# EAGLE design ssd1306-i2c-oled-breakout (EAGLE 6.6.0)
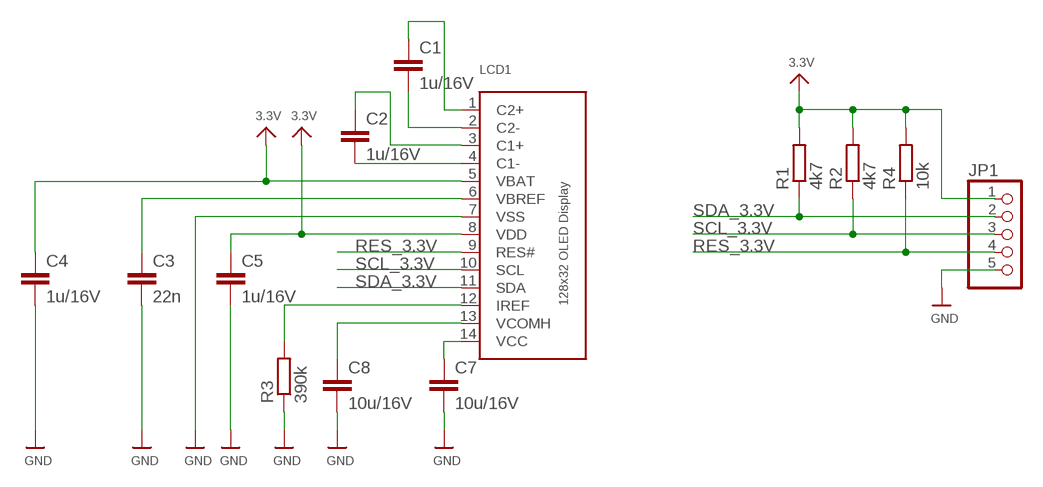
[diagram p0: schematic, sheet 1]

## Parts
C1  1u/16V  C-EUC0603  [C0603]
C2  1u/16V  C-EUC0603  [C0603]
C3  22n  C-EUC0603  [C0603]
C4  1u/16V  C-EUC0603  [C0603]
C5  1u/16V  C-EUC0603  [C0603]
C7  10u/16V  C-EUC0805  [C0805]
C8  10u/16V  C-EUC0805  [C0805]
JP1  PINHD-1X5  [1X05]
LCD1  DISP_OLED_UG-2832HSWEG02  [UG-2832HSWEG02_WRAPUNDER]
R1  4k7  R-EU_R0805  [R0805]
R2  4k7  R-EU_R0805  [R0805]
R3  390k  R-EU_R0603  [R0603]
R4  10k  R-EU_R0805  [R0805]

## Nets
3.3V: C4.1 C5.1 JP1.1 LCD1.5(VBAT) LCD1.8(VDD) R1.2 R2.2 R4.2
GND: C3.2 C4.2 C5.2 C7.2 C8.2 JP1.5 LCD1.7(VSS) R3.1
N$1: C2.2 LCD1.4(C1-)
N$2: C2.1 LCD1.3(C1+)
N$3: C1.2 LCD1.2(C2-)
N$4: C1.1 LCD1.1(C2+)
N$5: C7.1 LCD1.14(VCC)
N$6: C8.1 LCD1.13(VCOMH)
N$7: LCD1.12(IREF) R3.2
N$8: C3.1 LCD1.6(VBREF)
RES_3.3V: JP1.4 LCD1.9(RES#) R4.1
SCL_3.3V: JP1.3 LCD1.10(SCL) R2.1
SDA_3.3V: JP1.2 LCD1.11(SDA) R1.1

## Library data of the parts
C1-C5 C7 C8 = resistor:C-EU: CAPACITOR, European symbol
JP1 = pinhead:PINHD-1X5: PIN HEADER
LCD1 = microbuilder:DISP_OLED_UG-2832HSWEG02: 128x32 I2C 0.91" Monochrome OLED Display
R1-R4 = resistor:R-EU_: RESISTOR, European symbol

## Board
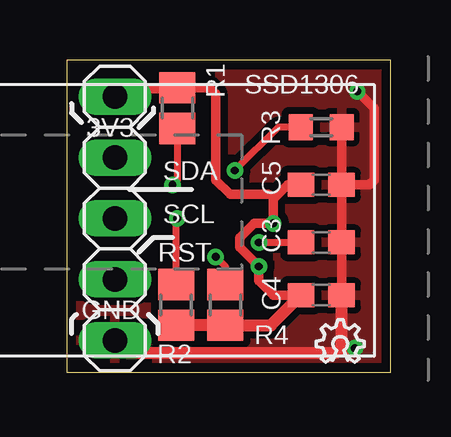
[diagram p1: board, top side]
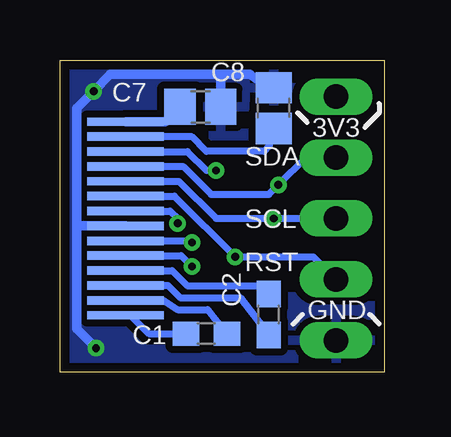
[diagram p2: board, bottom side, seen from below]

Size 13.5 x 13 mm. Coordinates in mm from the lower left corner, seen from the top.
Outline: 0,0 13.5,0 13.5,13 0,13 0,0
Copper layers (1*16): Top 0.0356mm / dielectric 1.5011mm / Bottom 0.0356mm
Design rules "LaenPCBOrder *": minimum track width 6mil, minimum drill 13mil, track to track 6mil, track to pad 6mil, pad to pad 6mil, via to via 6mil, smd to smd 0mil, copper to edge 15mil, drill to drill 6mil, minimum pad ring 7mil, minimum via ring 7mil, stop-mask expansion 3mil, vias tented up to drill 0.4mm, thermal gap 10mil

### Footprints (pad centres in the part's own frame; a part is rotated, then mirrored left to right if it is on the bottom)
C0603 = smd 1.1 x 1: 1 -0.85,0; 2 0.85,0
C0805 = smd 1.3 x 1.5: 1 -0.85,0; 2 0.85,0
1X05 = drill 1.016 long: 1 -5.08,0; 2 -2.54,0; 3 0,0; 4 2.54,0; 5 5.08,0
UG-2832HSWEG02_WRAPUNDER = smd 3.2 x 0.35 bottom: 1 -2.03,-4.03; 2 -2.03,-3.41; 3 -2.03,-2.79; 4 -2.03,-2.17; 5 -2.03,-1.55; 6 -2.03,-0.93; 7 -2.03,-0.31; 8 -2.03,0.31; 9 -2.03,0.93; 10 -2.03,1.55; 11 -2.03,2.17; 12 -2.03,2.79; 13 -2.03,3.41; 14 -2.03,4.03
R0805 = smd 1.3 x 1.5: 1 -0.85,0; 2 0.85,0
R0603 = smd 1 x 1.1: 1 -0.85,0; 2 0.85,0

### Placement (x,y rotation side)
C1  7.4,1.6 0 bottom
C2  4.8,2.4 90 bottom
C3  10.6,5.4 0 top
C4  10.6,3.2 0 top
C5  10.6,7.8 0 top
C7  7.65,11.05 0 bottom
C8  4.6,11 90 bottom
JP1  2,6.4 270 top
LCD1  12.8,6.4 0 top
R1  4.6,11 90 top
R2  4.55,2.8 270 top
R3  10.6,10.2 180 top
R4  6.6,2.8 270 top
U$12  [OSHW_6X70_NOTEXT]  10.4,0.4 0 top

### Tracks (layer width: path | path; a pad name or v marks a point on that pad's centre or on a via)
3.3V  (via drill 0.33)
  Top 0.3: 9.2,7.8 C5.1 | 8.4,7.4 8.6,7.2
  Top 0.4: JP1.1 2.88,11.48 3.2,11.8 4.55,11.8 R1.2 5.95,11.85 6.2,11.6 6.2,8 6.8,7.4 8.4,7.4 | 9.2,7.8 8.6,7.2 v8.6,6.2 7.8,6.2 7.2,5.6 7.2,5.2 v8,4.4 8,3.8 8.6,3.2 C4.1
  Top 0.5: R2.2 R4.2 8.5,1.95 C4.1
  Bottom 0.3: LCD1.5 8.45,4.85 v8,4.4 | LCD1.8 8.91,6.71 8.6,6.4 v8.6,6.2
GND  (via drill 0.33)
  Top 0.4: R3.1 C5.2 | C5.2 C3.2 C4.2 | C5.2 12.6,7.8 12.8,8 12.8,11 v12.1,11.7 | v12,1 11.8,0.8 2.52,0.8
  Top 0.5: JP1.5 2.52,0.8 11.2,0.8 11.45,1.05 C4.2
  Bottom 0.4: 12.8,6.2 12.8,11 v12.1,11.7 11.4,12.4 6.8,12.4 | LCD1.7 12.69,6.09 12.8,6.2 | C8.2 4.65,11.9 4.9,11.9 5.6,12.4 6.8,12.4 | C7.2 6.8,12.4 | 12.8,6.2 12.8,1.8 v12,1
  pour Bottom (isolate 0.3): 0,13 13.6,13 13.6,0 0,0
  pour Top (isolate 0.3): 0,13 13.6,13 13.6,0 0,0
N$1
  Bottom 0.3: LCD1.4 8.83,4.23 8.2,3.6 5.15,3.6 C2.2
N$2
  Bottom 0.3: LCD1.3 9.01,3.61 8.5,3.1 6,3.1 C2.1
N$3
  Bottom 0.3: LCD1.2 9.19,2.99 8.6,2.6 7.35,2.6 C1.2
N$4
  Bottom 0.3: LCD1.1 10.57,2.37 9.8,1.6 C1.1
N$5
  Bottom 0.4: LCD1.14 9.12,10.43 C7.1
N$6
  Bottom 0.3: C8.1 4.8,9.4 5,9.2 7.4,9.2 8,9.8 LCD1.13
N$7  (via drill 0.33)
  Top 0.3: R3.2 8.8,10.2 v7,8.4
  Bottom 0.3: LCD1.12 8.19,9.19 7.4,8.4 v7,8.4
N$8  (via drill 0.33)
  Top 0.3: v8,5.4 C3.1
  Bottom 0.3: LCD1.6 8.07,5.47 v8,5.4
RES_3.3V  (via drill 0.33)
  Top 0.3: R4.1 6.6,4.4 v6.2,4.8
  Bottom 0.3: 2.34,4.2 JP1.4 2.94,4.8 v6.2,4.8 8.73,7.33 LCD1.9
SCL_3.3V  (via drill 0.33)
  Top 0.3: R2.1 4.55,6.35 v4.6,6.4
  Bottom 0.3: LCD1.10 8.55,7.95 7,6.4 v4.6,6.4 JP1.3
SDA_3.3V  (via drill 0.33)
  Top 0.3: R1.1 4.6,8 v4.4,7.8
  Bottom 0.3: LCD1.11 8.37,8.57 7.2,7.4 4.8,7.4 v4.4,7.8 3.26,8.94 JP1.2

### Text on the board
tNames: SSD1306 | 3V3 | SDA | SCL | RST | GND
bNames: 3V3 | SDA | SCL | RST | GND